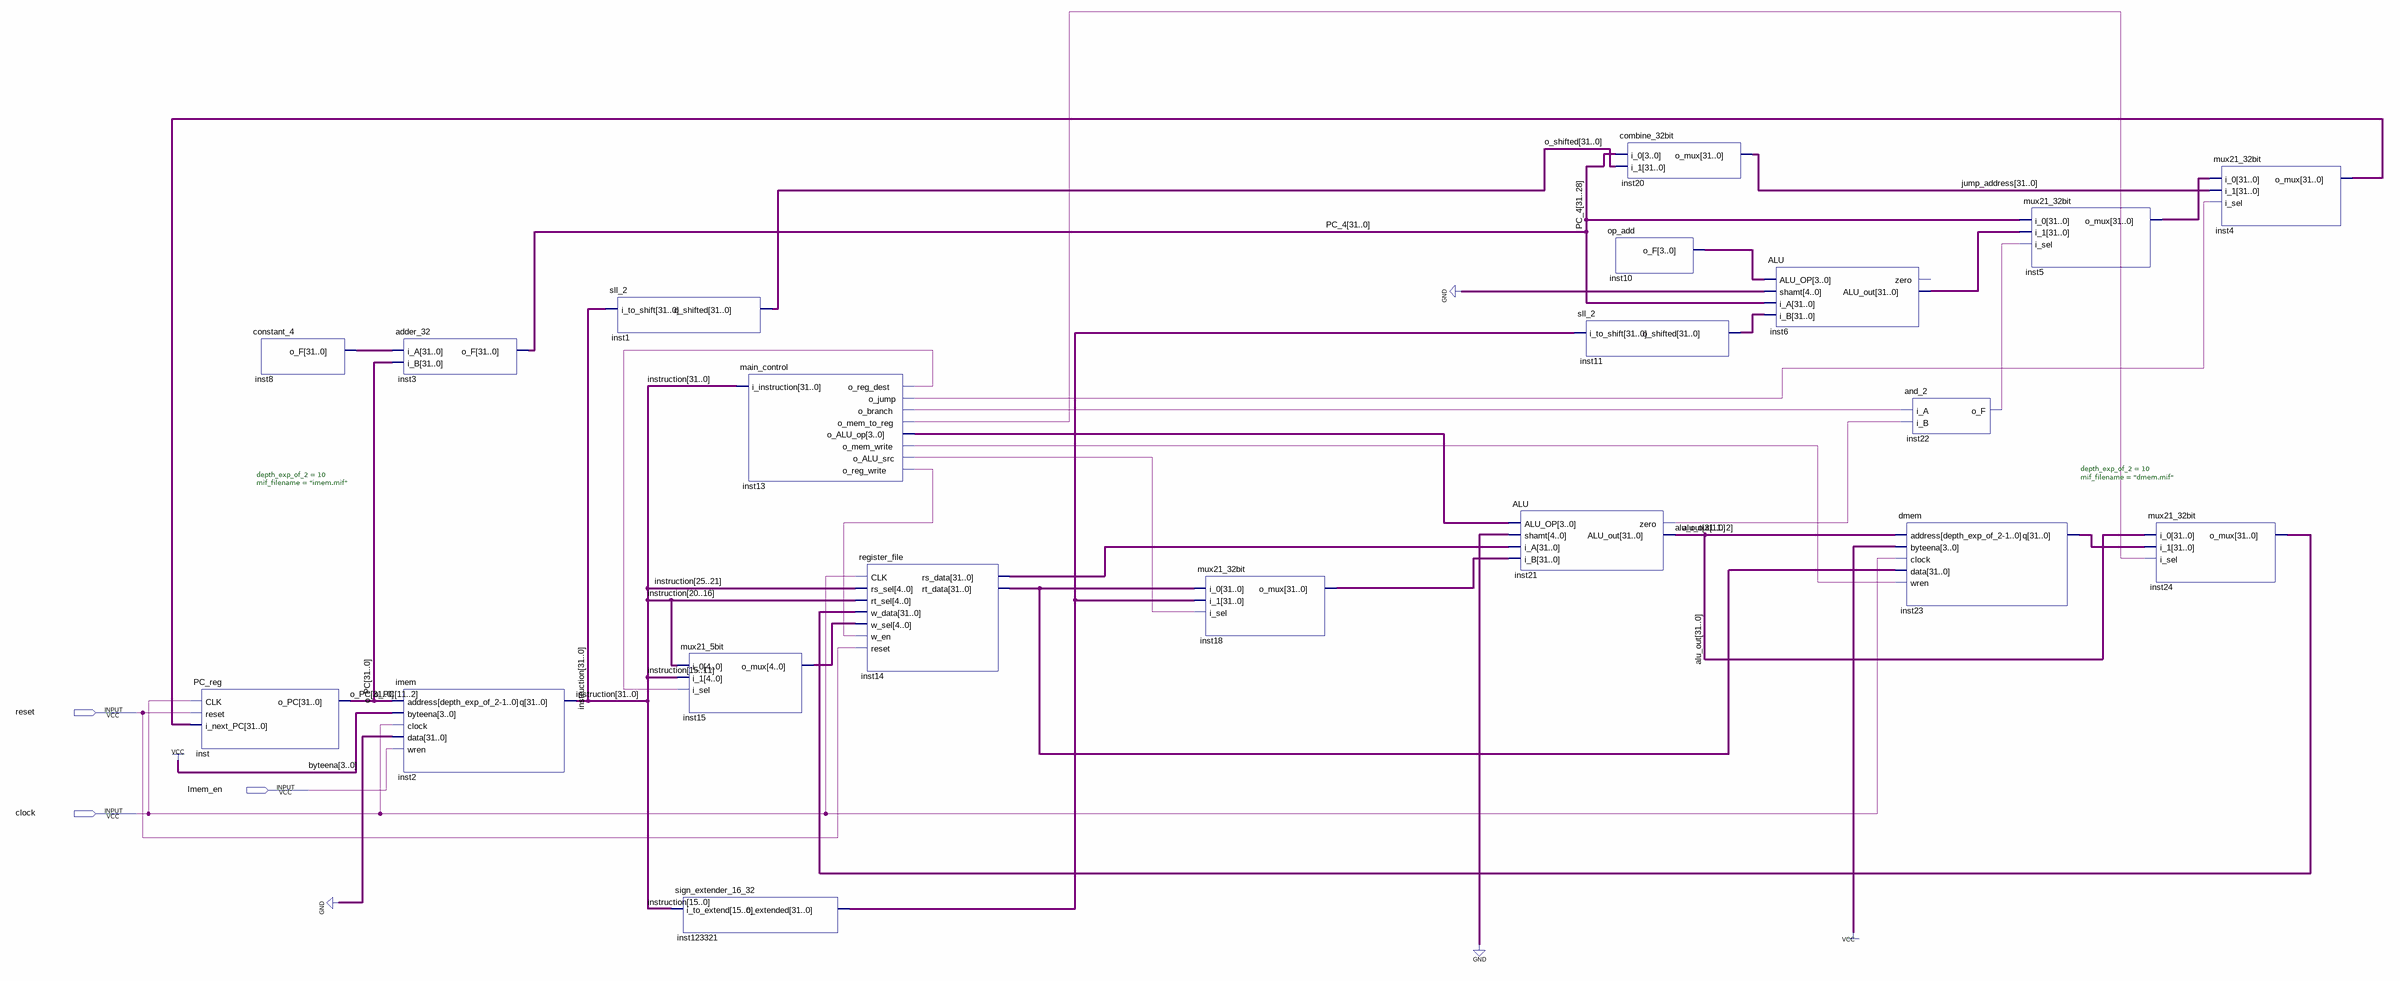
[diagram p0: schematic sheet]
// Quartus schematic projectA.bdf as structural Verilog: 20 symbols, 3 pins
module projectA (
  input  reset,
  input  Imem_en,
  input  clock
);

  wire inst13_o_alu_src, inst13_o_branch, inst13_o_jump, inst13_o_mem_to_reg, inst13_o_mem_write,
       inst13_o_reg_dest, inst13_o_reg_write, inst21_zero, inst22_o_f;
  wire [3:0] inst10_o_f, inst13_o_alu_op;
  wire [4:0] inst15_o_mux;
  wire [31:0] alu_out, inst4_o_mux, inst5_o_mux, inst6_alu_out, inst8_o_f, inst11_o_shifted, inst14_rs_data,
       inst14_rt_data, inst18_o_mux, inst23_q, inst24_o_mux, inst123321_o_extended, instruction,
       jump_address, o_PC, o_shifted, PC_4;

  PC_reg inst (.CLK(clock), .reset(reset), .i_next_PC(inst4_o_mux), .o_PC(o_PC));
  constant_4 inst8 (.o_F(inst8_o_f));
  adder_32 inst3 (.i_A(inst8_o_f), .i_B(o_PC), .o_F(PC_4));
  imem #(.depth_exp_of_2(10), .mif_filename("imem.mif")) inst2 (
    .address(o_PC[11:2]), .byteena(4'b1111), .clock(clock), .data({32{1'b0}}), .wren(Imem_en), .q(instruction));
  sll_2 inst1 (.i_to_shift(instruction), .o_shifted(o_shifted));
  mux21_5bit inst15 (
    .i_0(instruction[20:16]), .i_1(instruction[15:11]), .i_sel(inst13_o_reg_dest), .o_mux(inst15_o_mux));
  sign_extender_16_32 inst123321 (.i_to_extend(instruction[15:0]), .o_extended(inst123321_o_extended));
  main_control inst13 (
    .i_instruction(instruction), .o_reg_dest(inst13_o_reg_dest), .o_jump(inst13_o_jump),
    .o_branch(inst13_o_branch), .o_mem_to_reg(inst13_o_mem_to_reg), .o_ALU_op(inst13_o_alu_op),
    .o_mem_write(inst13_o_mem_write), .o_ALU_src(inst13_o_alu_src), .o_reg_write(inst13_o_reg_write));
  register_file inst14 (
    .CLK(clock), .rs_sel(instruction[25:21]), .rt_sel(instruction[20:16]), .w_data(inst24_o_mux),
    .w_sel(inst15_o_mux), .w_en(inst13_o_reg_write), .reset(reset), .rs_data(inst14_rs_data),
    .rt_data(inst14_rt_data));
  mux21_32bit inst18 (
    .i_0(inst14_rt_data), .i_1(inst123321_o_extended), .i_sel(inst13_o_alu_src), .o_mux(inst18_o_mux));
  ALU inst21 (
    .ALU_OP(inst13_o_alu_op), .shamt({5{1'b0}}), .i_A(inst14_rs_data), .i_B(inst18_o_mux),
    .zero(inst21_zero), .ALU_out(alu_out));
  combine_32bit inst20 (.i_0(PC_4[31:28]), .i_1(o_shifted), .o_mux(jump_address));
  op_add inst10 (.o_F(inst10_o_f));
  sll_2 inst11 (.i_to_shift(inst123321_o_extended), .o_shifted(inst11_o_shifted));
  ALU inst6 (
    .ALU_OP(inst10_o_f), .shamt({5{1'b0}}), .i_A(PC_4), .i_B(inst11_o_shifted), .ALU_out(inst6_alu_out));  // open: zero
  and_2 inst22 (.i_A(inst13_o_branch), .i_B(inst21_zero), .o_F(inst22_o_f));
  dmem #(.depth_exp_of_2(10), .mif_filename("dmem.mif")) inst23 (
    .address(alu_out[11:2]), .byteena(4'b1111), .clock(clock), .data(inst14_rt_data),
    .wren(inst13_o_mem_write), .q(inst23_q));
  mux21_32bit inst5 (.i_0(PC_4), .i_1(inst6_alu_out), .i_sel(inst22_o_f), .o_mux(inst5_o_mux));
  mux21_32bit inst24 (.i_0(alu_out), .i_1(inst23_q), .i_sel(inst13_o_mem_to_reg), .o_mux(inst24_o_mux));
  mux21_32bit inst4 (.i_0(inst5_o_mux), .i_1(jump_address), .i_sel(inst13_o_jump), .o_mux(inst4_o_mux));
endmodule
